# Altium schematic sheet 7_FUROS_E_TEST_POINTS.SchDoc
size Tabloid; SheetNumber: 7; SheetTotal: 7
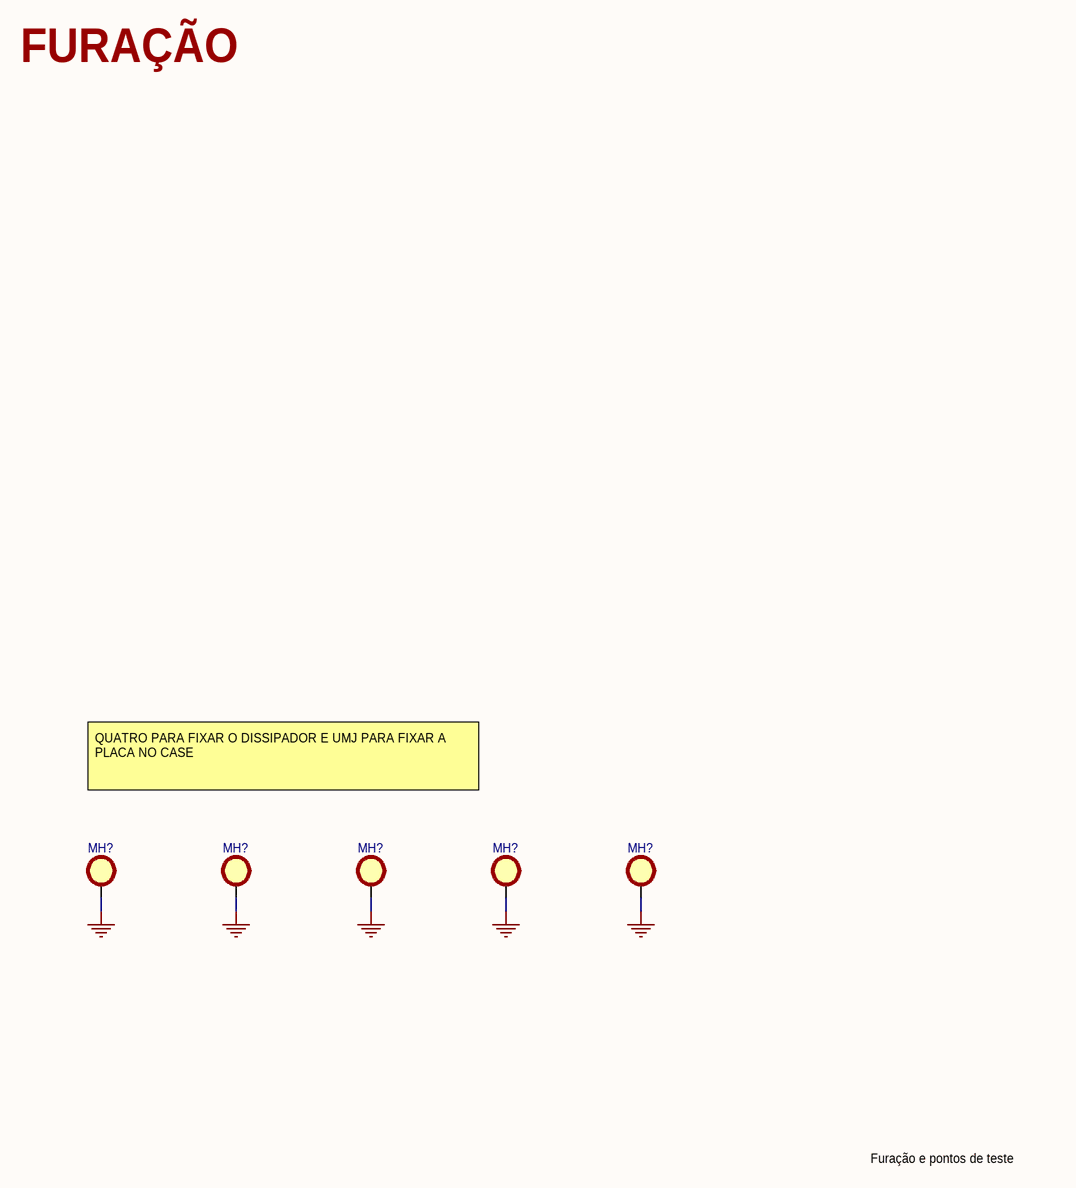
[diagram p0: 7_FUROS_E_TEST_POINTS.SchDoc]

## Parts
(Parts that share a designator on the sheet are numbered #1, #2 ... from top to bottom, then left to right.)
MH?#1  Mounting Hole 2.5mm  [MOUNTING_HOLE_M2P5_PLATED]  (value not drawn)  (no BOM)
MH?#2  Mounting Hole 2.5mm  [MOUNTING_HOLE_M2P5_PLATED]  (value not drawn)  (no BOM)
MH?#3  Mounting Hole 2.5mm  [MOUNTING_HOLE_M2P5_PLATED]  (value not drawn)  (no BOM)
MH?#4  Mounting Hole 2.5mm  [MOUNTING_HOLE_M2P5_PLATED]  (value not drawn)  (no BOM)
MH?#5  Mounting Hole 2.5mm  [MOUNTING_HOLE_M2P5_PLATED]  (value not drawn)  (no BOM)

## Nets
GND: MH?#1.H MH?#2.H MH?#3.H MH?#4.H MH?#5.H

## Notes on the sheet
- FURAÇÃO
- QUATRO PARA FIXAR O DISSIPADOR E UMJ PARA FIXAR A PLACA NO CASE
- Furação e pontos de teste
- Title:
- Size:
- Tabloid
- Number:
- Sheet of:
- Revision:
- Date:
- Project Name:
- Drawn By:

## Library data of the parts
MH?#1-MH?#5 = MTH-2P5MM-PLATED: PLATED MOUNTING HOLE WITH 2.5MM DIAMETER